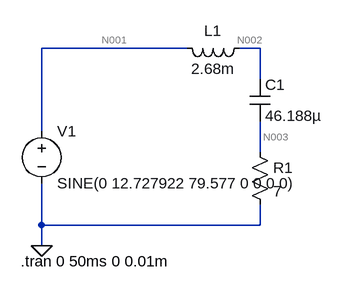
[diagram p0: schematic scheme1.asc]
scheme1.asc, the LTspice schematic file:
Version 4
SHEET 1 880 680
WIRE 368 -16 144 -16
WIRE 480 -16 448 -16
WIRE 480 32 480 -16
WIRE 144 112 144 -16
WIRE 480 144 480 96
WIRE 144 256 144 192
WIRE 480 256 480 224
WIRE 480 256 144 256
WIRE 144 288 144 256
FLAG 144 288 0
SYMBOL voltage 144 96 R0
WINDOW 123 0 0 Left 0
WINDOW 39 0 0 Left 0
SYMATTR InstName V1
SYMATTR Value SINE(0 12.727922 79.577 0 0 0 0)
SYMBOL ind 464 -32 R90
WINDOW 0 5 56 VBottom 2
WINDOW 3 32 56 VTop 2
SYMATTR InstName L1
SYMATTR Value 2.68m
SYMATTR SpiceLine Rser=5
SYMBOL res 464 128 R0
SYMATTR InstName R1
SYMATTR Value 7
SYMBOL cap 464 32 R0
SYMATTR InstName C1
SYMATTR Value 46.188µ
TEXT 112 312 Left 2 !.tran 0 50ms 0 0.01m

The netlist it stands for:
* scheme1.asc
V1 N001 0 SINE(0 12.727922 79.577 0 0 0 0)
L1 N002 N001 2.68m Rser=5
R1 N003 0 7
C1 N002 N003 46.188µ
.tran 0 50ms 0 0.01m
.backanno
.end

* Results of the author's LTspice run, read from the files saved beside the schematic
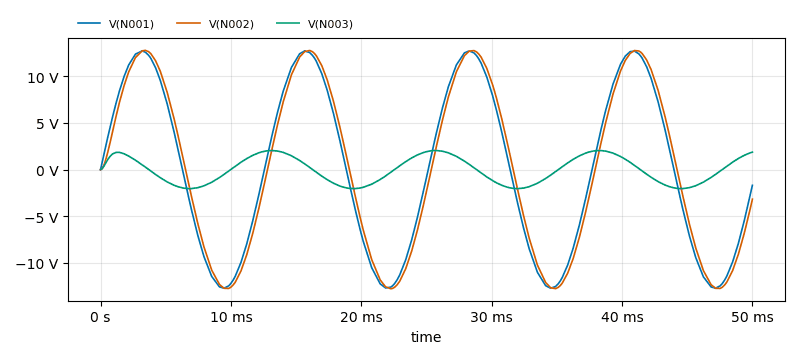
[diagram p1: Transient Analysis of scheme1.asc, plotted from the saved traces]
* Transient Analysis, 1 run:
*   V(N001): min -12.73 V, max 12.73 V, average 6.255 mV, rms 9.015 V, last -1.686 V
*   V(N002): min -12.79 V, max 12.79 V, average 15.1 mV, rms 9.06 V, last -3.179 V
*   V(N003): min -2.041 V, max 2.041 V, average -32.55 mV, rms 1.42 V, last 1.871 V